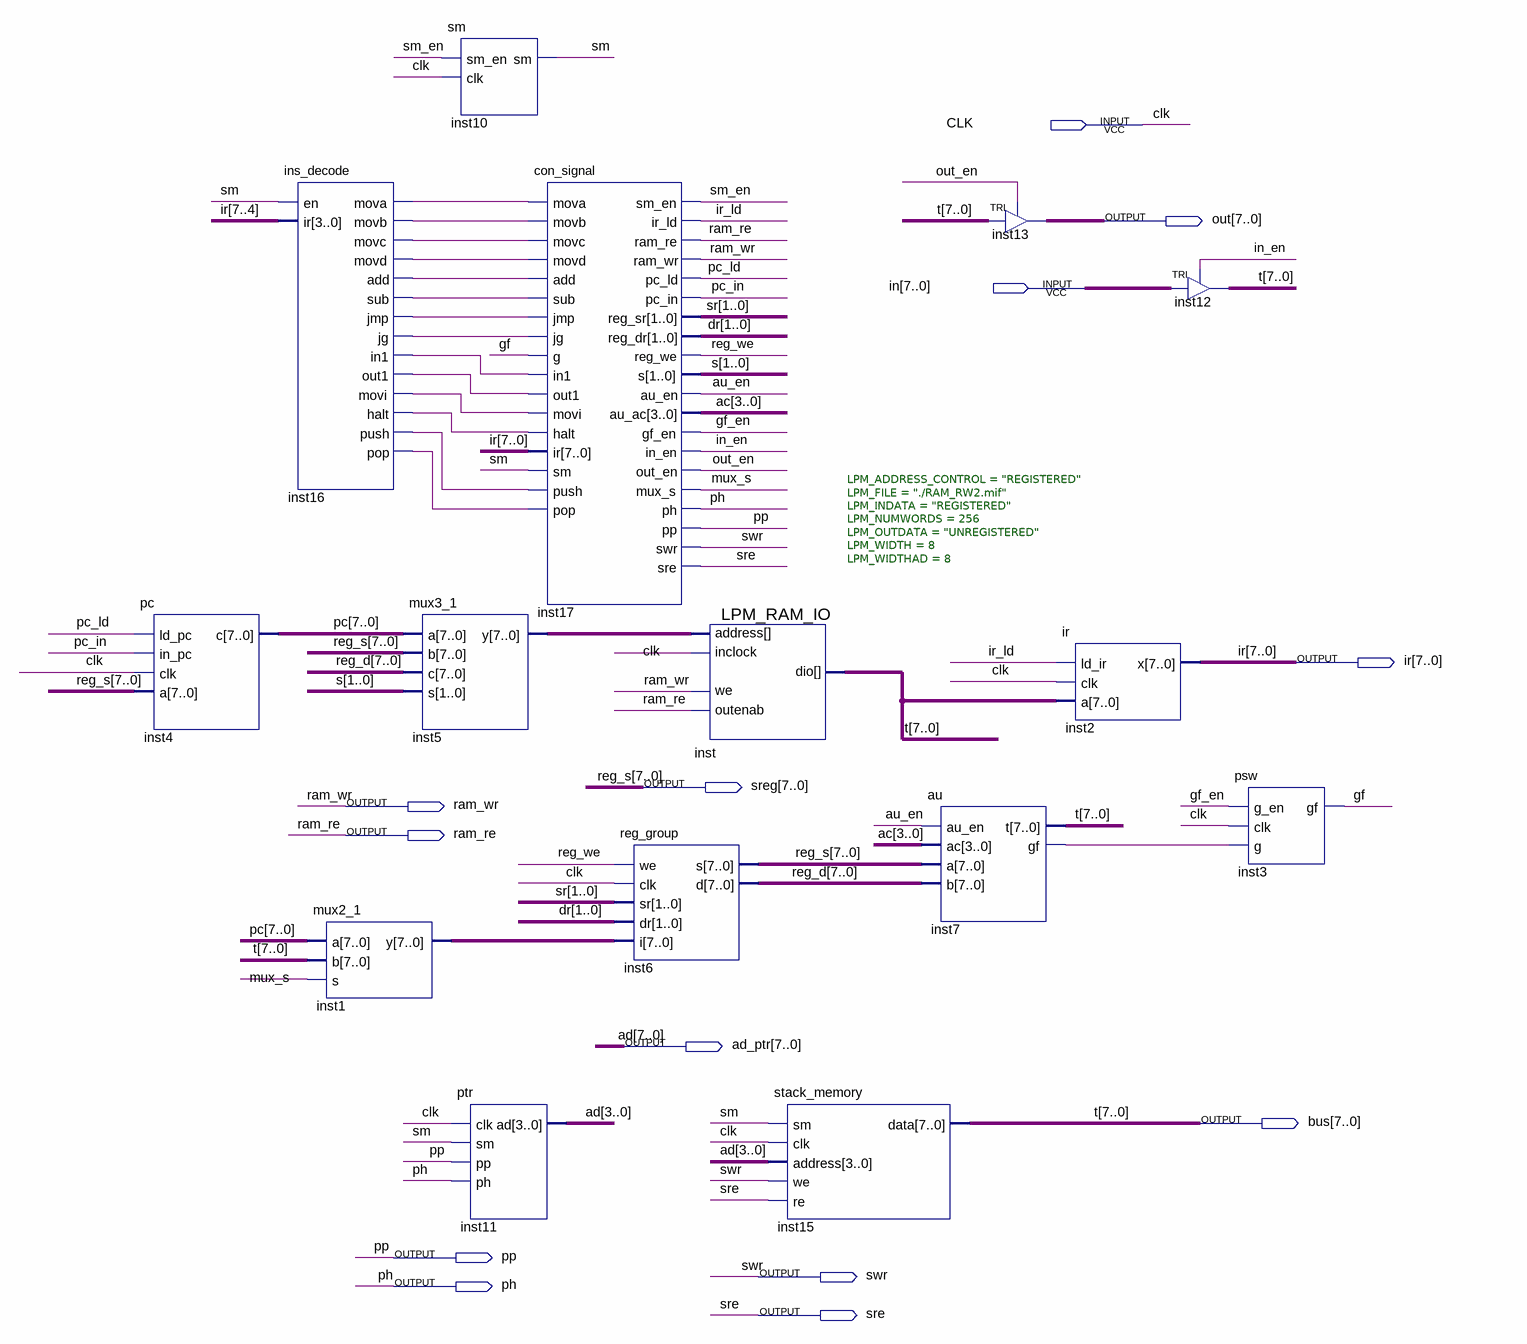
[diagram p0: schematic sheet]
// Quartus schematic my_computer.bdf as structural Verilog: 15 symbols, 13 pins
module my_computer (
  input  CLK,
  input  [7:0] in,
  output [7:0] out,
  output [7:0] ir,
  output [7:0] sreg,
  output ram_wr,
  output ram_re,
  output [7:0] ad_ptr,
  output [7:0] bus,
  output pp,
  output swr,
  output ph,
  output sre
);

  wire au_en, gf, gf_en, in_en, inst7_gf, inst16_add, inst16_halt, inst16_in1, inst16_jg, inst16_jmp,
       inst16_mova, inst16_movb, inst16_movc, inst16_movd, inst16_movi, inst16_out1, inst16_pop, inst16_push,
       inst16_sub, ir_ld, mux_s, out_en, pc_in, pc_ld, reg_we, sm, sm_en;
  wire [1:0] dr, s, sr;
  wire [3:0] ac;
  wire [7:0] inst1_y, inst5_y, pc, reg_d;

  pc inst4 (.ld_pc(pc_ld), .in_pc(pc_in), .clk(CLK), .a(sreg), .c(pc));
  ins_decode inst16 (
    .en(sm), .ir(ir[7:4]), .mova(inst16_mova), .movb(inst16_movb), .movc(inst16_movc), .movd(inst16_movd),
    .add(inst16_add), .sub(inst16_sub), .jmp(inst16_jmp), .jg(inst16_jg), .in1(inst16_in1),
    .out1(inst16_out1), .movi(inst16_movi), .halt(inst16_halt), .push(inst16_push), .pop(inst16_pop));
  mux2_1 inst1 (.a(pc), .b(bus), .s(mux_s), .y(inst1_y));
  sm inst10 (.sm_en(sm_en), .clk(CLK), .sm(sm));
  mux3_1 inst5 (.a(pc), .b(sreg), .c(reg_d), .s(s), .y(inst5_y));
  ptr inst11 (.clk(CLK), .sm(sm), .pp(pp), .ph(ph), .ad(ad_ptr[3:0]));
  con_signal inst17 (
    .mova(inst16_mova), .movb(inst16_movb), .movc(inst16_movc), .movd(inst16_movd), .add(inst16_add),
    .sub(inst16_sub), .jmp(inst16_jmp), .jg(inst16_jg), .g(gf), .in1(inst16_in1), .out1(inst16_out1),
    .movi(inst16_movi), .halt(inst16_halt), .ir(ir), .sm(sm), .push(inst16_push), .pop(inst16_pop),
    .sm_en(sm_en), .ir_ld(ir_ld), .ram_re(ram_re), .ram_wr(ram_wr), .pc_ld(pc_ld), .pc_in(pc_in),
    .reg_sr(sr), .reg_dr(dr), .reg_we(reg_we), .s(s), .au_en(au_en), .au_ac(ac), .gf_en(gf_en),
    .in_en(in_en), .out_en(out_en), .mux_s(mux_s), .ph(ph), .pp(pp), .swr(swr), .sre(sre));
  reg_group inst6 (.we(reg_we), .clk(CLK), .sr(sr), .dr(dr), .i(inst1_y), .s(sreg), .d(reg_d));
  LPM_RAM_IO #(.LPM_ADDRESS_CONTROL("REGISTERED"), .LPM_FILE("./RAM_RW2.mif"), .LPM_INDATA("REGISTERED"), .LPM_NUMWORDS(256), .LPM_OUTDATA("UNREGISTERED"), .LPM_WIDTH(8), .LPM_WIDTHAD(8)) inst (
    .address(inst5_y), .inclock(CLK), .we(ram_wr), .outenab(ram_re), .dio(bus));
  stack_memory inst15 (.sm(sm), .clk(CLK), .address(ad_ptr[3:0]), .we(swr), .re(sre), .data(bus));
  au inst7 (.au_en(au_en), .ac(ac), .a(sreg), .b(reg_d), .t(bus), .gf(inst7_gf));
  TRI inst13[7:0] (.IN(bus), .OE(out_en), .OUT(out));
  ir inst2 (.ld_ir(ir_ld), .clk(CLK), .a(bus), .x(ir));
  TRI inst12[7:0] (.IN(in), .OE(in_en), .OUT(bus));
  psw inst3 (.g_en(gf_en), .clk(CLK), .g(inst7_gf), .gf(gf));

  // Other names for the same wires on the sheet: ad[7:0] = ad_ptr; reg_s[7:0] = sreg; t[7:0] = bus
endmodule
